# EasyEDA Pro project ProProject_智能车越野组英飞凌主板_2023-12-23.epro, schematic Schematic1_2

## Sheets
1 PWR: Create Date: 2023-11-16; Page Name: PWR; Project Name: 极速越野组别英飞凌主板; Schematic Name: Schematic1_2; Update Date: 2023-11-16; Company: 嘉立创EDA; Page Size: A4; Version: V1.0
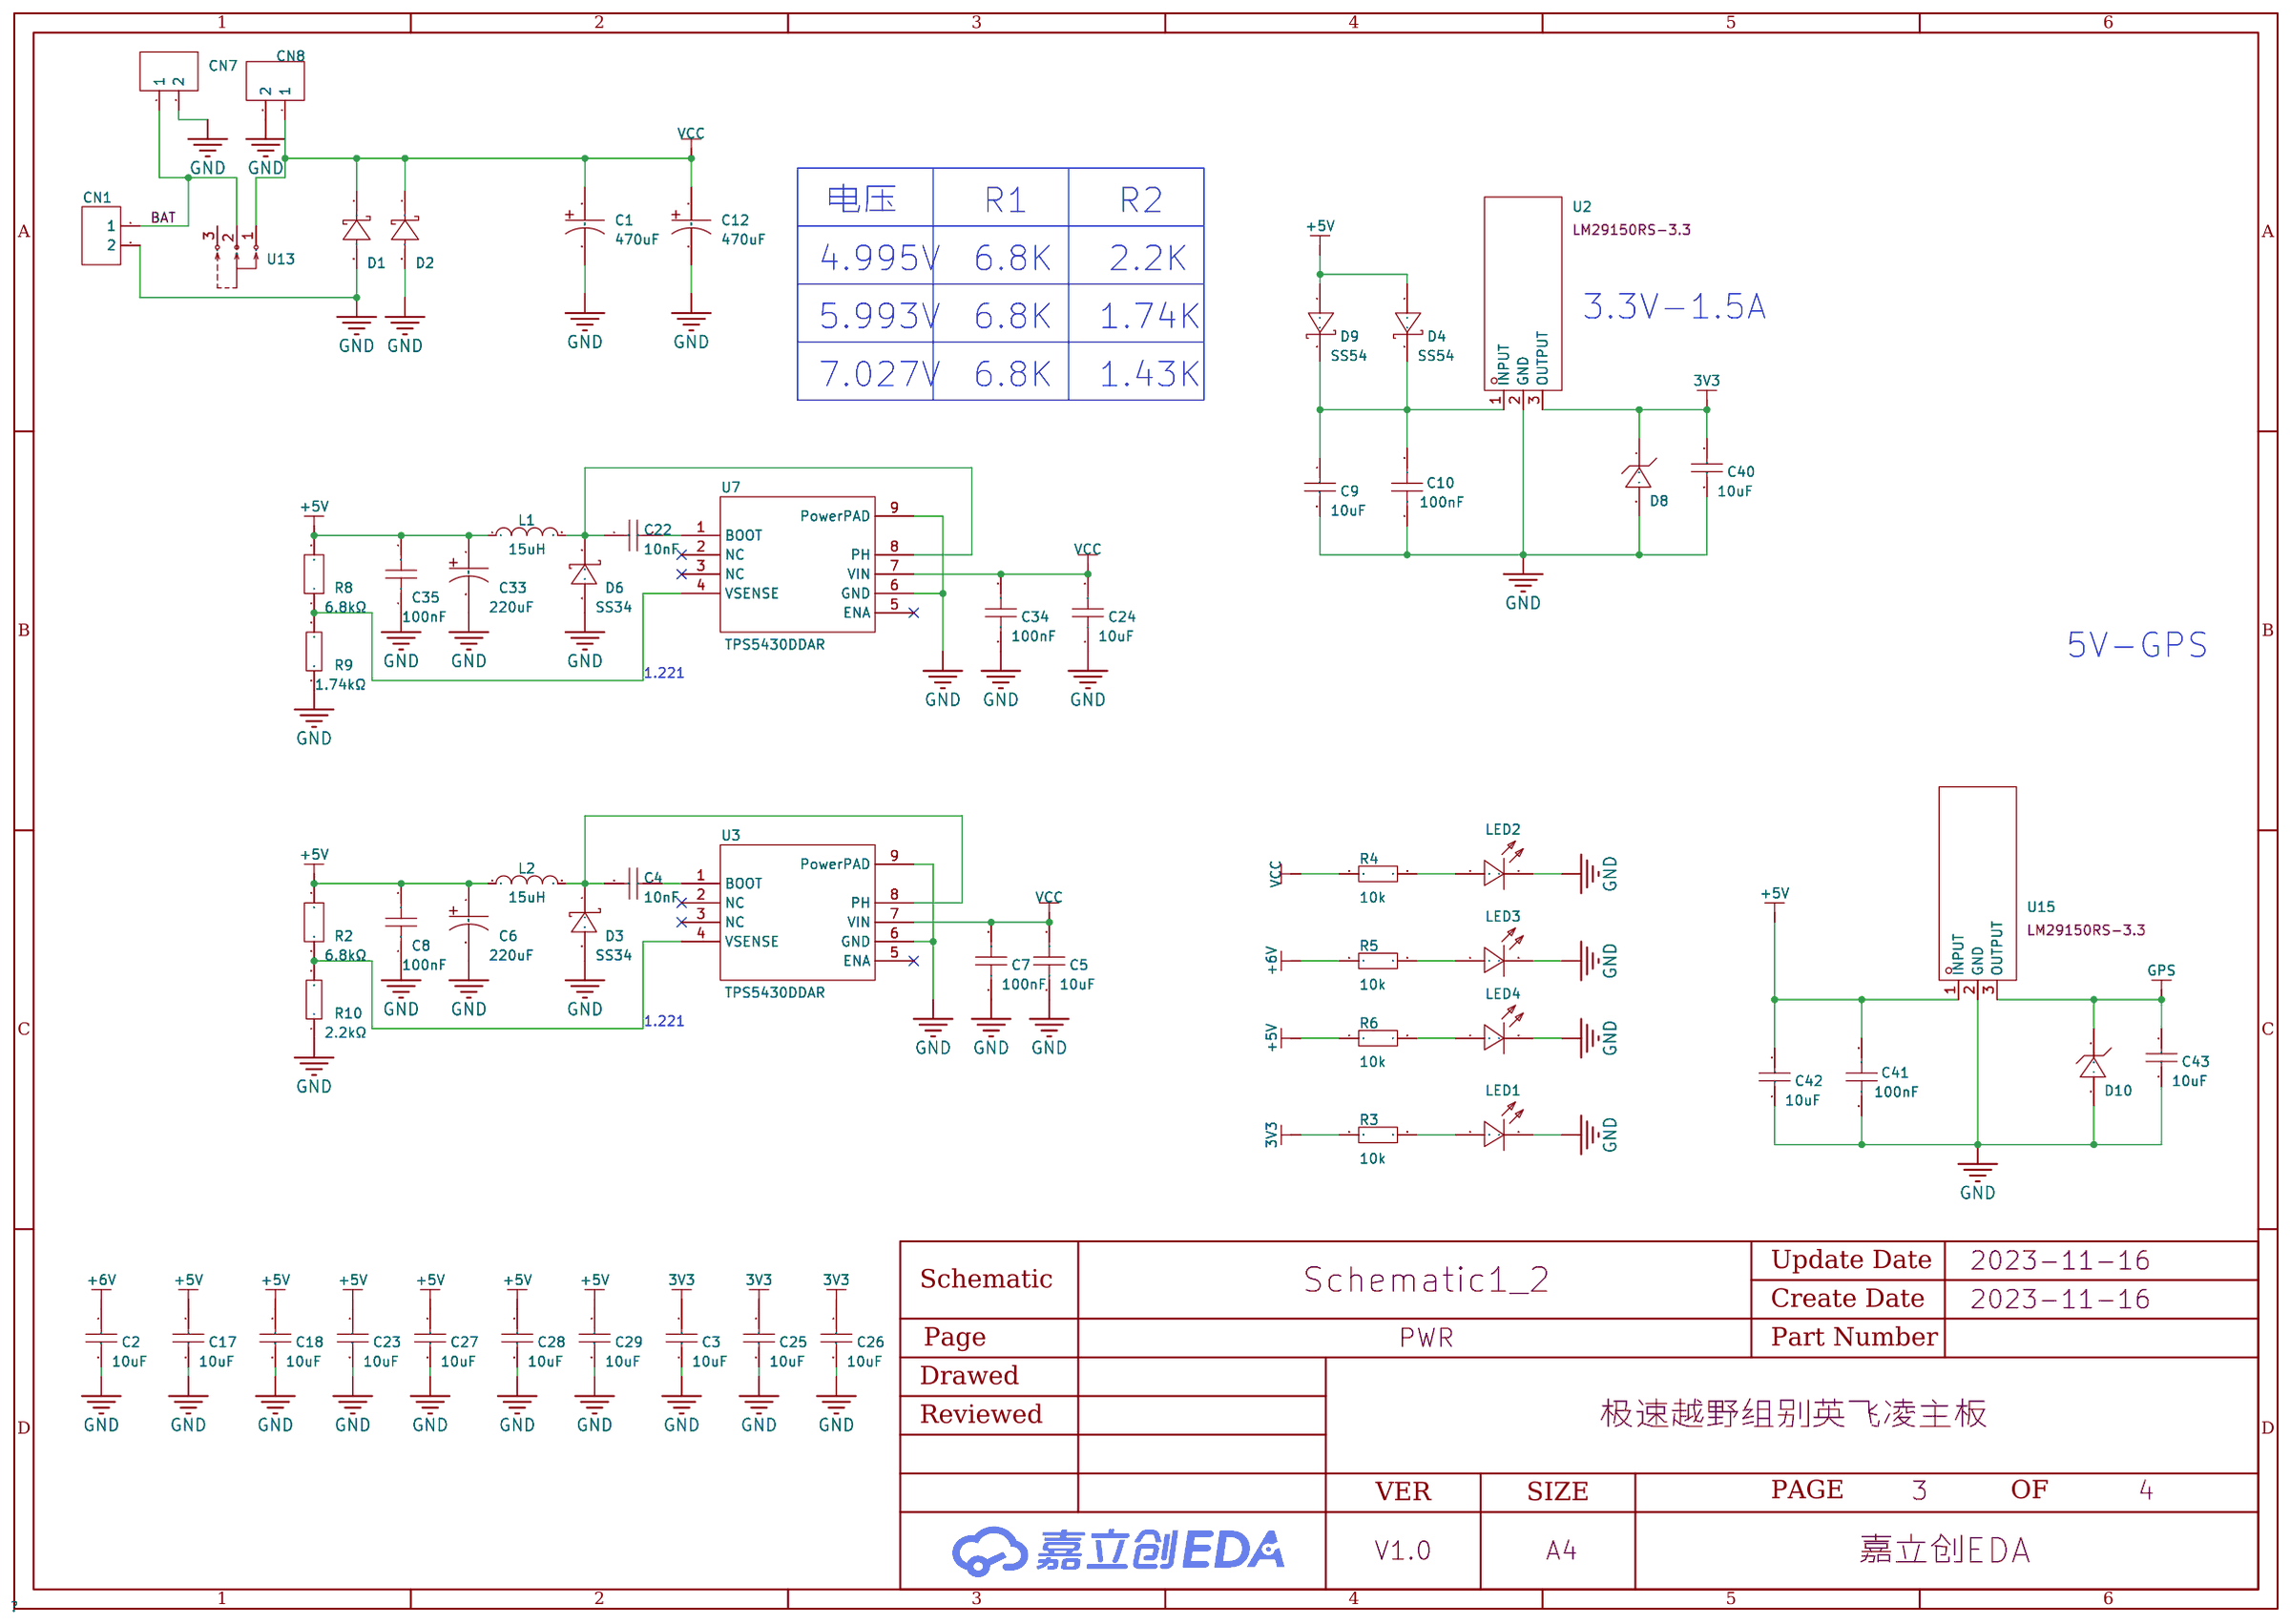
[diagram p0: PWR]
2 CTRL
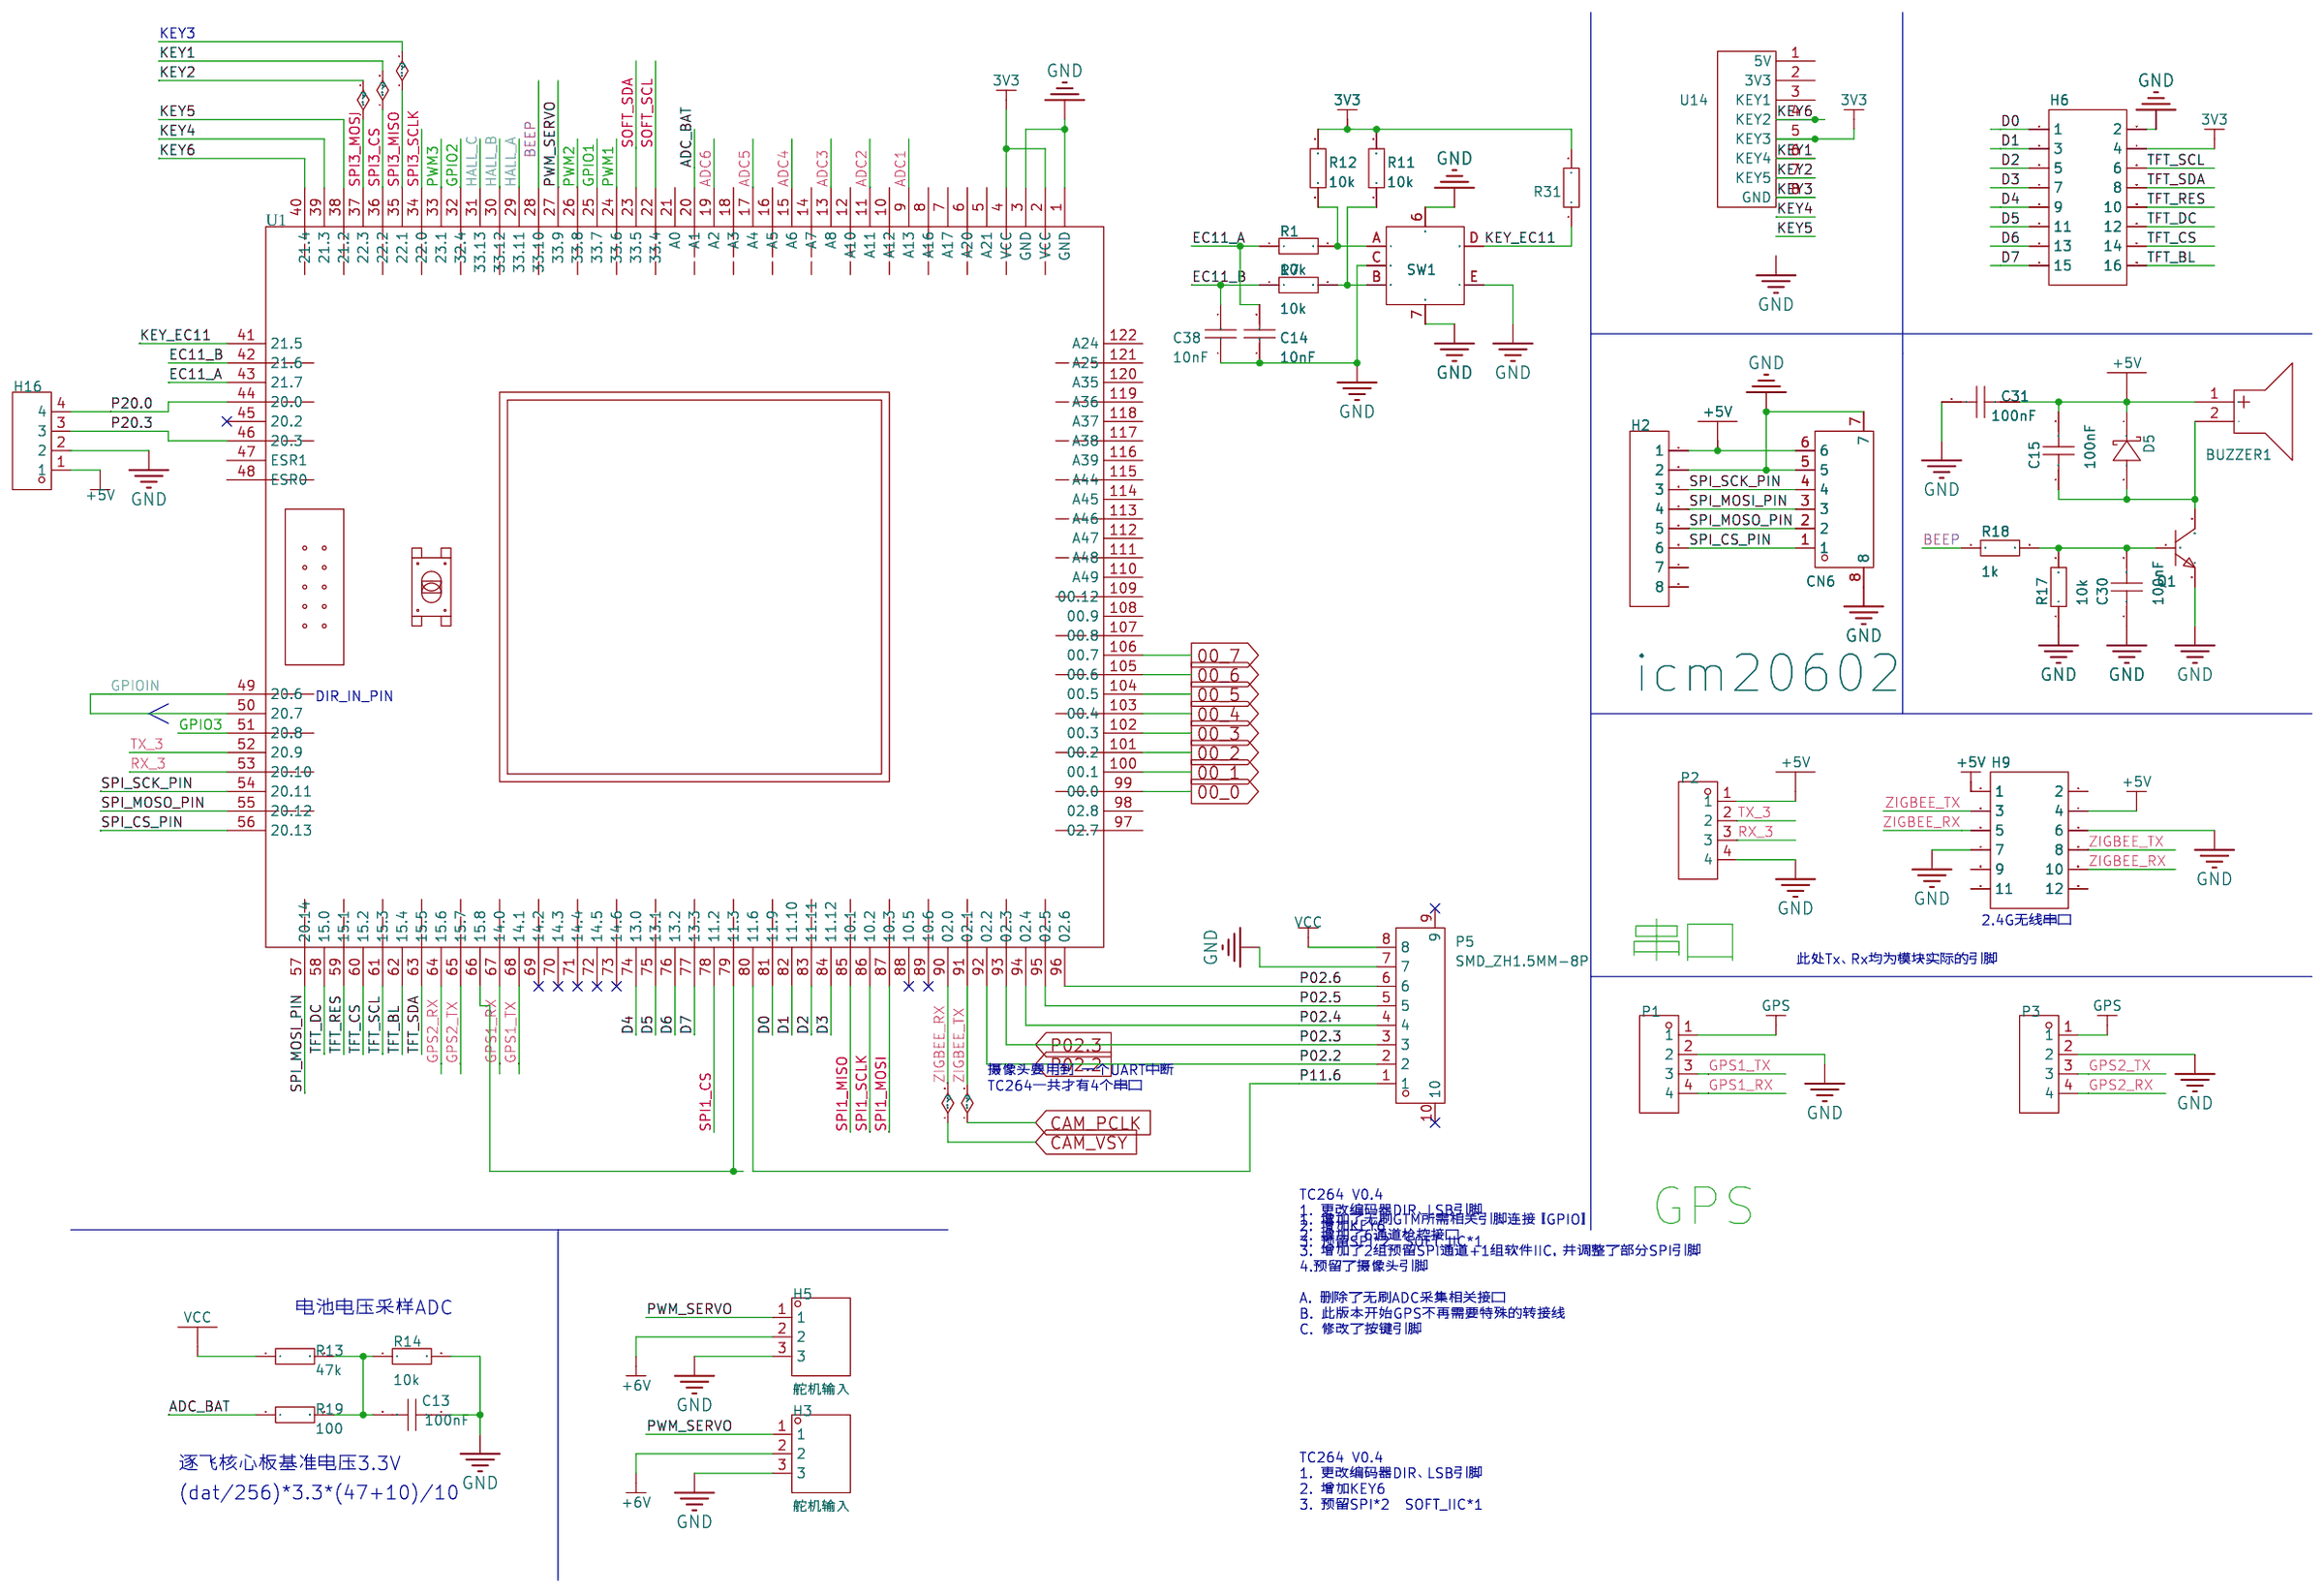
[diagram p1: CTRL]
3 BLDC
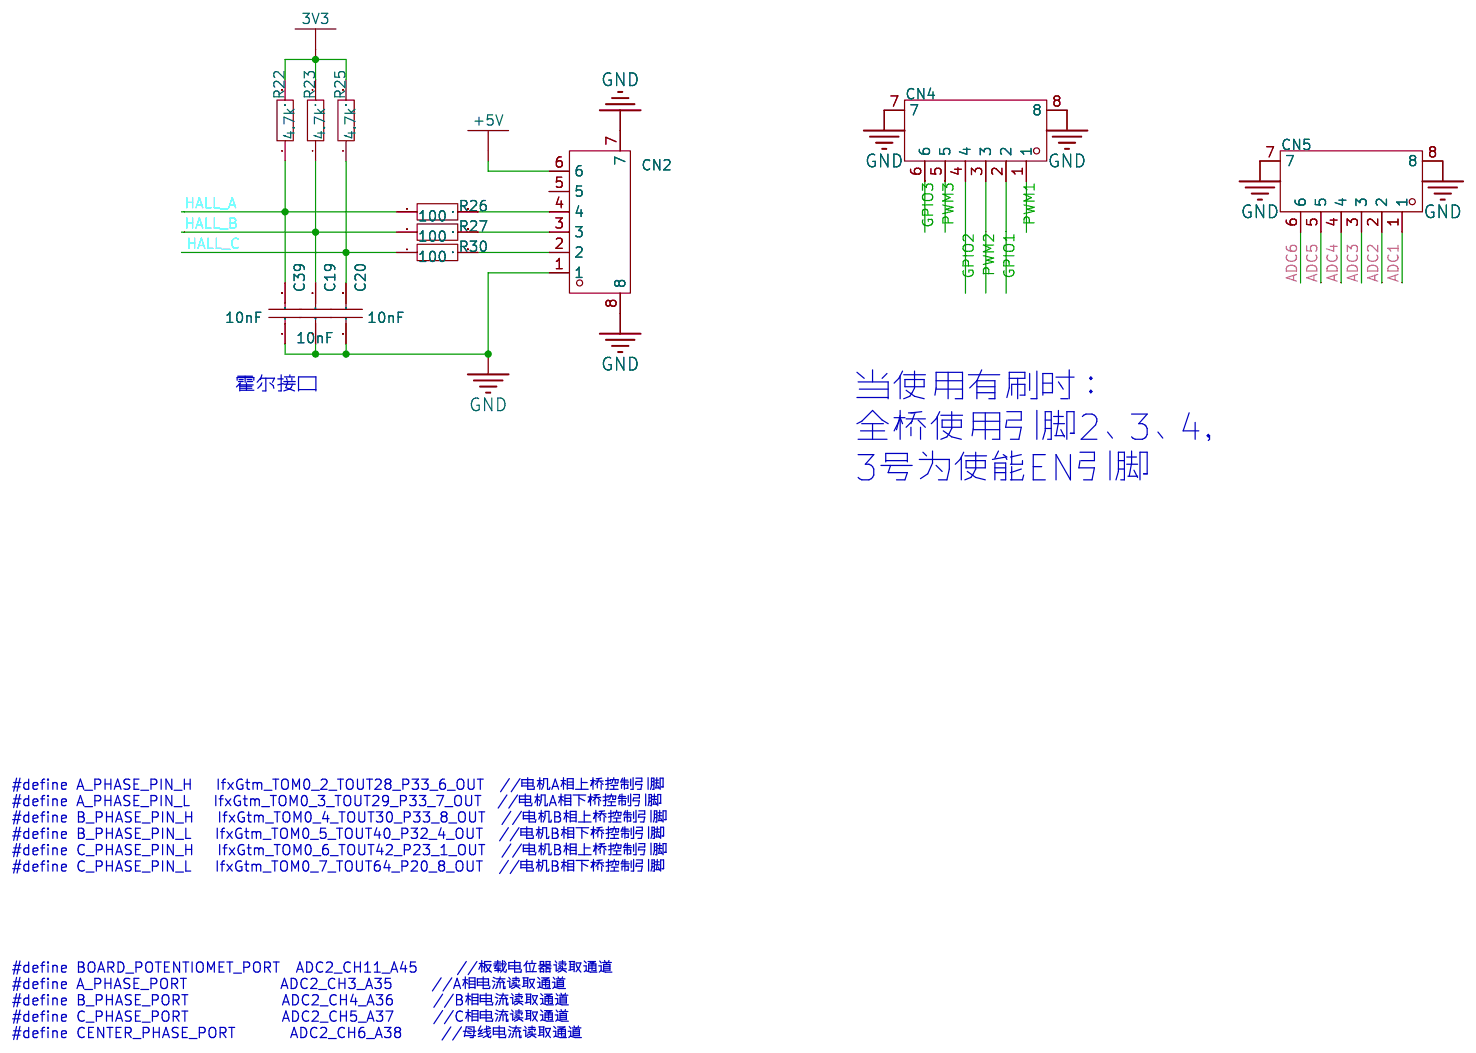
[diagram p2: BLDC]
4 STAND: Page Name: STAND; Company: 深圳嘉立创科技发展有限公司; Drawed: 嘉立创EDA; Page Size: A2; Part Number: JLCPCB-001; Reviewed: 嘉立创EDA; Version: V0.1
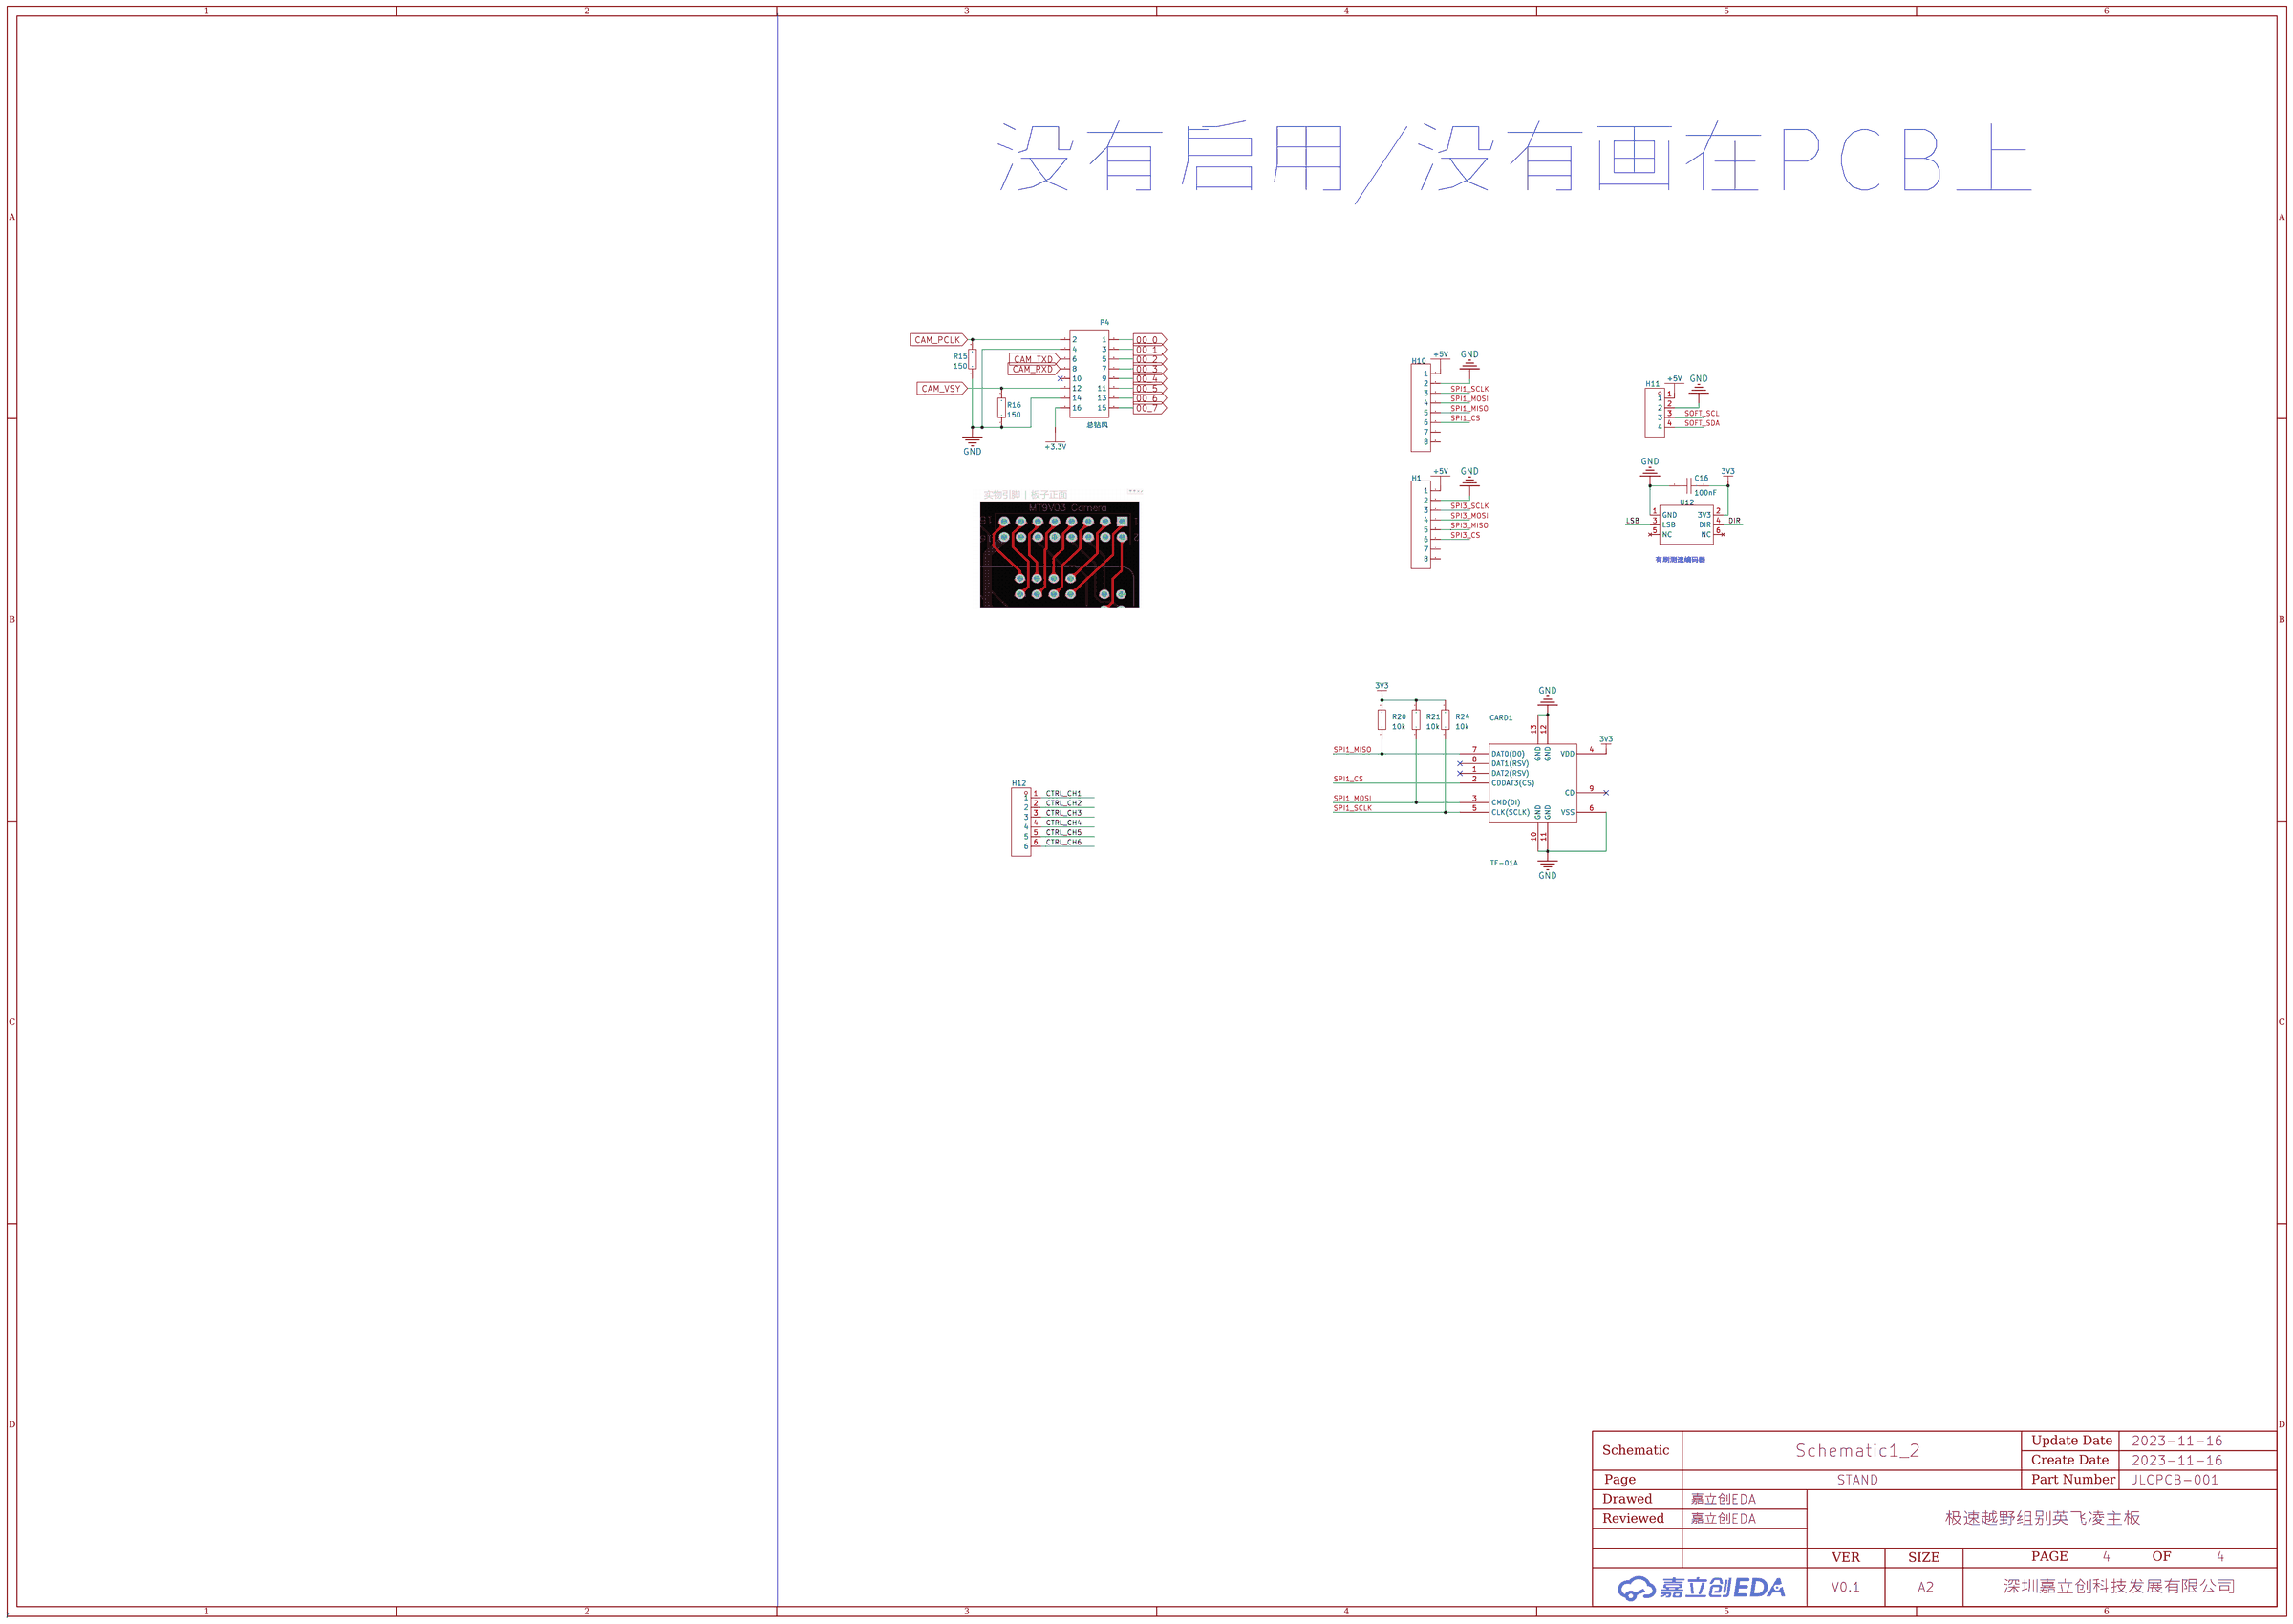
[diagram p3: STAND]

## Parts
sheet BLDC
C19  10nF  [C0603]
C20  10nF  [C0603]
C39  10nF  [C0603]
CN2  KH-ZH1.5WF-06A  [CONN-SMD_KH-ZH1.5WF-06A]
CN4  KH-ZH1.5WF-06A  [CONN-SMD_KH-ZH1.5WF-06A]
CN5  KH-ZH1.5WF-06A  [CONN-SMD_KH-ZH1.5WF-06A]
R22  4.7k  [R0603]
R23  4.7k  [R0603]
R25  4.7k  [R0603]
R26  100  [R0603]
R27  100  [R0603]
R30  100  [R0603]
sheet CTRL
BUZZER1  2048Hz  [BUZ-TH_BD12.0-P6.50-D0.6-FD]
C13  100nF  [C0603]
C14  10nF  [C0603]
C15  100nF  [C0603_2]
C30  100nF  [C0603_2]
C31  100nF  [C0603_2]
C38  10nF  [C0603]
CN6  KH-ZH1.5WF-06A  [CONN-SMD_KH-ZH1.5WF-06A]
D5  -  [SOD-123_L2.7-W1.6-LS3.7-RD]
H2  icm20602  [HDR-TH_8P-P2.54-V-F-1]
H3  舵机输入  [HDR-TH_3P-P2.54-V-M-1]
H5  舵机输入  [HDR-TH_3P-P2.54-V-M-1]
H6  -  [HDR-TH_16P-P2.54-V-M-R2-C8-S2.54]
H9  2.54-2*6P母  [HDR-TH_12P-P2.54-V-F-R2-C6-S2.54]
H16  -  [HDR-TH_4P-P2.54-V-F]
P1  陀螺仪  [CONN-TH_4P-P2.50-XH2.54-4P]
P2  陀螺仪  [CONN-TH_4P-P2.50-XH2.54-4P]
P3  陀螺仪  [CONN-TH_4P-P2.50-XH2.54-4P]
P5  SMD_ZH1.5MM-8P  [CONN-SMD_8P-P1.50_HCTL_HC-ZH-8PWT]
Q1  -  [SOT-23-3_L3.0-W1.7-P0.95-LS2.9-BR]
R1  10k  [R0603]
R7  10k  [R0603]
R11  10k  [R0603]
R12  10k  [R0603]
R13  47k  [R0603]
R14  10k  [R0603]
R17  10k  [R0603_3]
R18  1k  [R0603_3]
R19  100  [R0603]
R31  0603WAF4701T5E  [R0603]
SW1  EC11L1525E05  [SW-TH_EC11L1525E05]
U1  TC264_CoreBoard  [TC系列V0.2]
U14  -  [5个按键C]
sheet PWR
C1  470uF  [CAP-TH_BD8.0-P3.50-D0.6-FD_1]
C2  10uF  [C0805]
C3  10uF  [C0805]
C4  10nF  [C0603]
C5  10uF  [C0805]
C6  220uF  [CAP-TH_BD8.0-P3.50-D0.6-FD_1]
C7  100nF  [C0603]
C8  100nF  [C0603]
C9  10uF  [C0805]
C10  100nF  [C0603_1]
C12  470uF  [CAP-TH_BD8.0-P3.50-D0.6-FD_1]
C17  10uF  [C0805]
C18  10uF  [C0805]
C22  10nF  [C0603]
C23  10uF  [C0805]
C24  10uF  [C0805]
C25  10uF  [C0805]
C26  10uF  [C0805]
C27  10uF  [C0805]
C28  10uF  [C0805]
C29  10uF  [C0805]
C33  220uF  [CAP-TH_BD8.0-P3.50-D0.6-FD_1]
C34  100nF  [C0603]
C35  100nF  [C0603]
C40  10uF  [C0805]
C41  100nF  [C0603_1]
C42  10uF  [C0805]
C43  10uF  [C0805]
CN1  XT30UPB-F  [CONN-TH_XT30UPB-F]
CN7  XT30UPB-F  [CONN-TH_XT30UPB-F]
CN8  XT30UPB-F  [CONN-TH_XT30UPB-F]
D1  SMAJ12A  [DO-214AC_L4.3-W2.7-LS5.0-RD]  (no BOM)
D2  SMAJ12A  [DO-214AC_L4.3-W2.7-LS5.0-RD]  (no BOM)
D3  SS34  [DO-214AC_L4.3-W2.7-LS5.3-RD]
D4  SS54  [SMA_L4.4-W2.8-LS5.4-R-RD]
D6  SS34  [DO-214AC_L4.3-W2.7-LS5.3-RD]
D8  ZMM3V3-M  [LL-34_L3.5-W1.5-RD]
D9  SS54  [SMA_L4.4-W2.8-LS5.4-R-RD]
D10  ZMM3V3-M  [LL-34_L3.5-W1.5-RD]
L1  15uH  [IND-SMD_L7.4-W6.6]
L2  15uH  [IND-SMD_L7.4-W6.6]
LED1  KT-0603R  [LED0603-R-RD]
LED2  KT-0603R  [LED0603-R-RD]
LED3  KT-0603R  [LED0603-R-RD]
LED4  KT-0603R  [LED0603-R-RD]
R2  6.8kΩ  [R0603]
R3  10k  [R0603]
R4  10k  [R0603]
R5  10k  [R0603]
R6  10k  [R0603]
R8  6.8kΩ  [R0603]
R9  1.74kΩ  [R0603]
R10  2.2kΩ  [R0603]
U2  LM29150RS-3.3  [TO-252-2_L6.6-W6.1-P4.57-LS9.9-BR-CW]
U3  TPS5430DDAR  [SOIC-8_L5.0-W4.0-P1.27-LS6.0-BL-EP2.0]
U7  TPS5430DDAR  [SOIC-8_L5.0-W4.0-P1.27-LS6.0-BL-EP2.0]
U13  HX SS12D10G4  [SW-TH_SHOU-HAN_SS12D10G4]
U15  LM29150RS-3.3  [TO-252-2_L6.6-W6.1-P4.57-LS9.9-BR-CW]
sheet STAND
C16  100nF  [C0603_2]
CARD1  TF-01A  [TF-SMD_TF-01A]
H1  -  [HDR-TH_8P-P2.54-V-F-1]
H10  -  [HDR-TH_8P-P2.54-V-F-1]
H11  -  [HDR-TH_4P-P2.54-V-F]
H12  -  [HDR-TH_6P-P2.54-V-F_1]
P4  总钻风  [HDR-TH_16P-P2.54-V-M-R2-C8-S2.54]
R15  150  [R0603_3]
R16  150  [R0603_3]
R20  10k  [R0603]
R21  10k  [R0603]
R24  10k  [R0603]
U12  带方向编码器A  [IDC-TH_6P-P2.54_C11214]

## Library data of the parts
C4 C14 C19 C20 C22 C38 C39 = 0603B103K500NT: 容值:10nF;精度:±10%;额定电压:50V;材质(温度系数):X7R;; LCSC Part Name: 10nF ±10% 50V; Supplier Part: C57112; Manufacturer: FH(风华); Supplier Footprint: 0603; JLCPCB Part Class: 基础库; Datasheet: https://atta.szlcsc.com/upload/public/pdf/source/20170923/C57112_1506149495135988846.pdf; Supplier: LCSC; Tolerance: ±10%; Voltage Rated: 50V; Temperature Coefficient: X7R
CN2 CN4-CN6 = KH-ZH1.5WF-06A: 参考系列:-;间距:1.5mm;插针结构:1x6P;排数:1;每排PIN数:6;行距:-;公母:公型插针;安装方式:卧贴;额定电流:500mA;工作温度范围:-25℃~+85℃;; LCSC Part Name: 6P 1.5mm; Supplier Part: C2688783; Manufacturer: kinghelm(金航标); Supplier Footprint: SMD,P=1.5mm; JLCPCB Part Class: 扩展库; Datasheet: https://atta.szlcsc.com/upload/public/pdf/source/20210202/C2688783_C9B428B3014D7ABB89BDB1FE60180D57.pdf; Supplier: LCSC; Pitch: 1.5mm; Pins Structure: 1x6P; Number of Rows: 1; Number of PINs Per Row: 6; Gender: 公型插针; Mounting Style: 卧贴; Current Rating (Max): 500mA; Operating Temperature Range: -25℃~+85℃
R22 R23 R25 = 0603WAF4701T5E: 电阻类型:厚膜电阻;阻值:4.7k;精度:±1%;功率:1/10W;温度系数:±100ppm/;最大工作电压:75V;工作温度范围:-55~+155;; LCSC Part Name: 4.7k ±1%; Supplier Part: C23162; Manufacturer: UNI-ROYAL(厚声); Supplier Footprint: 0603; Datasheet: https://atta.szlcsc.com/upload/public/pdf/source/20200306/C422600_1E6D84923E4A46A82E41ADD87F860B5C.pdf; Supplier: LCSC; Type: 厚膜电阻; Tolerance: ±1%; Power(Watts): 1/10W; Temperature Coefficient: ±100ppm/; Overload Voltage (Max): 75V; Operating Temperature Range: -55~+155; JLCPCB Part Class: Basic Part
R19 R26 R27 R30 = 0603WAF1000T5E: 电阻类型:厚膜电阻;阻值:100;精度:±1%;功率:1/10W;温度系数:±200ppm/;最大工作电压:75V;工作温度范围:-55~+155;; LCSC Part Name: 100 ±1%; Supplier Part: C22775; Manufacturer: UNI-ROYAL(厚声); Supplier Footprint: 0603; Datasheet: https://atta.szlcsc.com/upload/public/pdf/source/20200306/C422600_1E6D84923E4A46A82E41ADD87F860B5C.pdf; Supplier: LCSC; Type: 厚膜电阻; Tolerance: ±1%; Power(Watts): 1/10W; Temperature Coefficient: ±200ppm/; Overload Voltage (Max): 75V; Operating Temperature Range: -55~+155; JLCPCB Part Class: Basic Part
BUZZER1 = GMC1205YA-16R2048: 驱动方式:无源(外部驱动);构造类型:电磁式;额定电压:3.3V;工作电压:2V~5V;频率:2048Hz;声压(SPL):80dB@3.3V,10cm;直径(φD):12mm;高度:5.6mm;; Supplier Part: C252915; Manufacturer: INGHAi(赢海); Supplier Footprint: 插件,P=6.5mm; JLCPCB Part Class: 扩展库; Datasheet: https://atta.szlcsc.com/upload/public/pdf/source/20180813/C252915_6F296D577EDE0D1B468E4E6A82DE9B37.pdf; Supplier: LCSC; Oscillator Circuit: 无源(外部驱动); Technology Type: 电磁式; Rated Voltage: 3.3V; Operating Voltage: 2V~5V; Sound Pressure Level (SPL): 80dB@3.3V,10cm; Diameter (φD): 12mm; Height: 5.6mm
C13 = CC0603KRX7R9BB104: 容值:100nF;精度:±10%;额定电压:50V;温度系数:X7R;; LCSC Part Name: 100nF ±10% 50V; Supplier Part: C14663; Manufacturer: YAGEO(国巨); Supplier Footprint: 0603; Datasheet: https://atta.szlcsc.com/upload/public/pdf/source/20170116/1484561234239.pdf; Supplier: LCSC; Tolerance: ±10%; Voltage Rated: 50V; Temperature Coefficient: X7R; JLCPCB Part Class: Basic Part
C15 C16 C30 C31 = CC0603KRX7R9BB104_4: 容值:100nF;精度:±10%;额定电压:50V;温度系数:X7R;; LCSC Part Name: 100nF ±10% 50V; Supplier Part: C14663; Manufacturer: YAGEO(国巨); Manufacturer Part: CC0603KRX7R9BB104; Supplier Footprint: 0603; Datasheet: https://atta.szlcsc.com/upload/public/pdf/source/20170116/1484561234239.pdf; Supplier: LCSC; Tolerance: ±10%; Voltage Rated: 50V; Temperature Coefficient: X7R; JLCPCB Part Class: Basic Part
D5 = 1N5819W_C963381: 二极管配置:独立式;直流反向耐压(Vr):40V;平均整流电流(Io):350mA;正向压降(Vf):600mV@200mA;反向电流(Ir):5A@30V;; LCSC Part Name: 40V 350mA 600mV@200mA; Supplier Part: C963381; Manufacturer: JSMSEMI(杰盛微); Manufacturer Part: 1N5819W; Supplier Footprint: SOD-123; Datasheet: https://atta.szlcsc.com/upload/public/pdf/source/20211201/C266112E93E924DFE0C071C9A8E85281.pdf; Supplier: LCSC; Diode Configuration: 独立式; Reverse Voltage (Vr): 40V; Average Rectified Current (Io): 350mA; Forward Voltage (Vf@If): 600mV@200mA; Reverse Leakage Current (Ir): 5A@30V; JLCPCB Part Class: Extended Part
H1 H2 H10 = HDR-F_2.54_1x8P: Supplier Part: C27438; Supplier Footprint: 插件
H3 H5 = 77311-102-03LF: 间距:2.54mm;总PIN位数:3;排数:1;插针结构:-;行距:-;安装类型:直插;圆针/方针:-;额定电流:-;额定电压:-;配合针长度:-;塑高:-;触头材质:磷青铜;触头镀层:-;颜色:黑色;; LCSC Part Name: 2.54mm; Supplier Part: C180248; Manufacturer: Amphenol; Supplier Footprint: 插件,P=2.54mm; Datasheet: https://atta.szlcsc.com/upload/public/pdf/source/20180329/C180248_62E264527695F7ED58561BB828D45E42.pdf; Supplier: LCSC; Pitch: 2.54mm; Number of Pins: 3; Number of Rows: 1; Mounting Type: 直插; Contact Material: 磷青铜; Color: 黑色; JLCPCB Part Class: Extended Part
H6 = HDR-M_2.54_2x8: Supplier Part: C68234; Supplier Footprint: 插件,P=2.54mm
H9 = 2.54-2*6P母: 间距:2.54mm;总孔位数:12;排数:2;插孔结构:2x6P;行距:2.54mm;安装类型:直插;塑高:-;触头材质:黄铜;触头镀层:-;; LCSC Part Name: 2.54mm 2x6P; Supplier Part: C36191; Manufacturer: BOOMELE(博穆精密); Supplier Footprint: 直插,P=2.54mm; JLCPCB Part Class: 扩展库; Datasheet: https://atta.szlcsc.com/upload/public/pdf/source/20151109/1457707557808.pdf; Supplier: LCSC; Pitch: 2.54mm; Number of Holes: 12; Number of Rows: 2; Holes Structure: 2x6P; Row Spacing: 2.54mm; Mounting Type: 直插; Contact Material: 黄铜
H11 H16 = HDR-F_2.54_1x4P: Supplier Part: C2718488; Supplier Footprint: 插件
P1-P3 = XH2.54-4P: Supplier Part: C9900003326; Supplier: LCSC; JLCPCB Part Class: Extended Part
P5 = SMD_ZH1.5MM-8P: Supplier Part: C9900016891; Supplier Footprint: ZH1.5-8P贴片卧式; JLCPCB Part Class: Extended Part; Datasheet: https://atta.szlcsc.comnull; Supplier: LCSC
Q1 = S8050 J3Y: 晶体管类型:NPN;集射极击穿电压(Vceo):25V;集电极电流(Ic):500mA;功率(Pd):300mW;集电极-发射极饱和电压(VCE(sat)@Ic,Ib):600mV@500mA,50mA;直流电流增益(hFE@Ic,Vce):200@50mA,1V;特征频率(fT):150MHz;工作温度:+150@(Tj);; LCSC Part Name: S8050 J3Y (200-350) (200-350); Supplier Part: C2146; Manufacturer: CJ（江苏长电/长晶）; Supplier Footprint: SOT-23(SOT-23-3); Datasheet: https://atta.szlcsc.com/upload/public/pdf/source/20140809/1457707209234.pdf; Supplier: LCSC; Transistor Type: NPN; Collector-Emitter Breakdown Voltage (Vceo): 25V; Collector Current (Ic): 500mA; Power Dissipation (Pd): 300mW; Collector-Emitter Saturation Voltage (VCE(sat)@Ic,Ib): 600mV@500mA,50mA; DC Current Gain (hFE@Ic,Vce): 200@50mA,1V; Transition Frequency (fT): 150MHz; Operating Temperature: +150@(Tj); JLCPCB Part Class: Basic Part
R1 R3-R7 R11 R12 R14 R20 R21 R24 = 0603WAF1002T5E: 电阻类型:厚膜电阻;阻值:10k;精度:±1%;功率:1/10W;温度系数:±100ppm/;最大工作电压:75V;工作温度范围:-55~+155;; LCSC Part Name: 10k ±1%; Supplier Part: C25804; Manufacturer: UNI-ROYAL(厚声); Supplier Footprint: 0603; Datasheet: https://atta.szlcsc.com/upload/public/pdf/source/20200306/C422600_1E6D84923E4A46A82E41ADD87F860B5C.pdf; Supplier: LCSC; Type: 厚膜电阻; Tolerance: ±1%; Power(Watts): 1/10W; Temperature Coefficient: ±100ppm/; Overload Voltage (Max): 75V; Operating Temperature Range: -55~+155; JLCPCB Part Class: Basic Part
R13 = 0603WAF4702T5E: 电阻类型:厚膜电阻;阻值:47k;精度:±1%;功率:1/10W;温度系数:±100ppm/;最大工作电压:75V;工作温度范围:-55~+155;; LCSC Part Name: 47k ±1%; Supplier Part: C25819; Manufacturer: UNI-ROYAL(厚声); Supplier Footprint: 0603; Datasheet: https://atta.szlcsc.com/upload/public/pdf/source/20200306/C422600_1E6D84923E4A46A82E41ADD87F860B5C.pdf; Supplier: LCSC; Type: 厚膜电阻; Tolerance: ±1%; Power(Watts): 1/10W; Temperature Coefficient: ±100ppm/; Overload Voltage (Max): 75V; Operating Temperature Range: -55~+155; JLCPCB Part Class: Basic Part
R17 = 0603WAF1002T5E_3: 电阻类型:厚膜电阻;阻值:10k;精度:±1%;功率:1/10W;温度系数:±100ppm/;最大工作电压:75V;工作温度范围:-55~+155;; LCSC Part Name: 10k ±1%; Supplier Part: C25804; Manufacturer: UNI-ROYAL(厚声); Manufacturer Part: 0603WAF1002T5E; Supplier Footprint: 0603; Datasheet: https://atta.szlcsc.com/upload/public/pdf/source/20200306/C422600_1E6D84923E4A46A82E41ADD87F860B5C.pdf; Supplier: LCSC; Type: 厚膜电阻; Tolerance: ±1%; Power(Watts): 1/10W; Temperature Coefficient: ±100ppm/; Overload Voltage (Max): 75V; Operating Temperature Range: -55~+155; JLCPCB Part Class: Basic Part
R18 = 0603WAF1001T5E: 电阻类型:厚膜电阻;阻值:1k;精度:±1%;功率:1/10W;温度系数:±100ppm/;最大工作电压:75V;工作温度范围:-55~+155;; LCSC Part Name: 1k ±1%; Supplier Part: C21190; Manufacturer: UNI-ROYAL(厚声); Supplier Footprint: 0603; Datasheet: https://atta.szlcsc.com/upload/public/pdf/source/20200306/C422600_1E6D84923E4A46A82E41ADD87F860B5C.pdf; Supplier: LCSC; Type: 厚膜电阻; Tolerance: ±1%; Power(Watts): 1/10W; Temperature Coefficient: ±100ppm/; Overload Voltage (Max): 75V; Operating Temperature Range: -55~+155; JLCPCB Part Class: Basic Part
R31 = 0603WAF4701T5E_1: LCSC Part Name: 4.7KΩ(4701) ±1% 编带; Supplier Part: C23162; Manufacturer: UNI-ROYAL(厚声); Supplier Footprint: 0603; JLCPCB Part Class: 基础库; Datasheet: https://atta.szlcsc.com/upload/public/pdf/source/20170920/C23162_1505901109673982545.pdf; Supplier: LCSC
SW1 = EC11L1525E05: LCSC Part Name: 编码器; Supplier Part: C2687298; Manufacturer: ALPSALPINE(阿尔卑斯阿尔派); Supplier Footprint: 插件; JLCPCB Part Class: 扩展库; Datasheet: https://atta.szlcsc.com/upload/public/pdf/source/20210222/C2687298_D85F935961A23A0DB1B474C7A2A10B19.pdf; Supplier: LCSC
U1 = TC264_CoreBoard: ---TC264----; _: 3
U14 = 5个按键C
C1 C6 C12 C33 = RZW471M1EBK-0815: 容值:470uF;精度:±20%;额定电压:25V;电容体直径:8mm;电容体长度:15mm;脚间距:3.5mm;工作寿命:7000hrs@105℃;; LCSC Part Name: 470uF ±20% 25V; Supplier Part: C335050; Manufacturer: lelon(立隆); Supplier Footprint: 径向引线,8x15mm; JLCPCB Part Class: 扩展库; Datasheet: https://atta.szlcsc.com/upload/public/pdf/source/20181120/C335050_51DA6CA8493D35BF3B1E9837637D07CE.pdf; Supplier: LCSC; Tolerance: ±20%; Rated Voltage: 25V; φD: 8mm; L: 15mm; Lead Spacing: 3.5mm; Lifetime @ Temp: 7000hrs@105℃
C2 C3 C9 C17 C18 C23 C25-C29 C40 C42 C43 = CL21A106KAYNNNE: 容值:10uF;精度:±10%;额定电压:25V;温度系数:X5R;; LCSC Part Name: 10uF ±10% 25V; Supplier Part: C15850; Manufacturer: SAMSUNG(三星); Supplier Footprint: 0805; Datasheet: https://atta.szlcsc.com/upload/public/pdf/source/20160103/1457707679302.pdf; Supplier: LCSC; Tolerance: ±10%; Voltage Rated: 25V; Temperature Coefficient: X5R; JLCPCB Part Class: Basic Part
C5 C24 = GRT21BC71E106KE13L: 容值:10uF;精度:±10%;额定电压:-;材质(温度系数):-;; LCSC Part Name: 10uF ±10%; Supplier Part: C882505; Manufacturer: muRata(村田); Supplier Footprint: 0805; JLCPCB Part Class: 扩展库; Datasheet: https://atta.szlcsc.com/upload/public/pdf/source/20201228/C882505_6C63D8D57C6472D033E3095FB59E12C2.pdf; Supplier: LCSC; Tolerance: ±10%
C7 C8 C34 C35 = CL10B104KC8NNNC: 容值:100nF;精度:±10%;额定电压:100V;材质(温度系数):X7R;; LCSC Part Name: 100nF ±10% 100V; Supplier Part: C15725; Manufacturer: SAMSUNG(三星); Supplier Footprint: 0603; JLCPCB Part Class: 扩展库; Datasheet: https://atta.szlcsc.com/upload/public/pdf/source/20160103/1457707678663.pdf; Supplier: LCSC; Tolerance: ±10%; Voltage Rated: 100V; Temperature Coefficient: X7R
C10 C41 = CC0603KRX7R9BB104_1: 容值:100nF;精度:±10%;额定电压:50V;温度系数:X7R;; LCSC Part Name: 100nF ±10% 50V; Supplier Part: C14663; Manufacturer: YAGEO(国巨); Manufacturer Part: CC0603KRX7R9BB104; Supplier Footprint: 0603; Datasheet: https://atta.szlcsc.com/upload/public/pdf/source/20170116/1484561234239.pdf; Supplier: LCSC; Tolerance: ±10%; Voltage Rated: 50V; Temperature Coefficient: X7R; JLCPCB Part Class: Basic Part
CN1 CN7 CN8 = XT30UPB-F: 模型插头连接器; Supplier Part: C108769; Manufacturer: AMASS(艾迈斯); Supplier Footprint: 间距5mm; JLCPCB Part Class: 扩展库; Datasheet: https://atta.szlcsc.com/upload/public/pdf/source/20180126/C108769_15169557890251308829.pdf; Supplier: LCSC
D1 D2 = SMAJ12A_C2760874: 极性:单向;反向截止电压(Vrwm):12V;击穿电压(最小值):13.3V;击穿电压(最大值):14.7V;反向漏电流(Ir):5A;峰值脉冲电流(Ipp)@10/1000s:20.1A;最大钳位电压:19.9V;峰值脉冲功率(Ppp)@10/1000s:400W;; LCSC Part Name: 单向 12V 400W; Supplier Part: C2760874; Manufacturer: Slkor(萨科微); Supplier Footprint: DO-214AC; JLCPCB Part Class: 扩展库; Datasheet: https://atta.szlcsc.com/upload/public/pdf/source/20200225/C488404_33CF829A6BE74AA3BA3BAD7F337BBDC5.pdf; Supplier: LCSC; Polarity: 单向; Reverse Stand-Off Voltage (Vrwm): 12V; Breakdown Voltage (Min): 13.3V; Breakdown Voltage (Max): 14.7V; Reverse Leakage Current (Ir): 5A; Peak Pulse Current (Ipp)@10/1000μs: 20.1A; Maximum Clamping Voltage: 19.9V; Peak Pulse Power Dissipation (Ppp)@10/1000μs: 400W
D3 D6 = SS34_C8678: 40V,3A,VF=0.55V 3A; Supplier Part: C8678; Manufacturer: MDD; Supplier Footprint: SMA(DO-214AC); JLCPCB Part Class: 基础库; Datasheet: https://atta.szlcsc.com/upload/public/pdf/source/20220408/D0396E57A6E83C6AFC0ED25EC9EDE030.pdf; Supplier: LCSC
D4 D9 = SS54_C22452: 直流反向耐压(Vr):40V;平均整流电流(Io):5A;正向压降(Vf):550mV@5A;; LCSC Part Name: 40V 5A 550mV@5A; Supplier Part: C22452; Manufacturer: MDD; Supplier Footprint: SMA(DO-214AC); Datasheet: https://atta.szlcsc.com/upload/public/pdf/source/20190306/C22452_DC5E4F74C3B638F6D8E4C7650D5BF30E.pdf; Supplier: LCSC; Reverse Voltage (Vr): 40V; Average Rectified Current (Io): 5A; Forward Voltage (Vf@If): 550mV@5A
D8 D10 = ZMM3V3-M: 二极管配置:独立式;稳压值(标称值):3.3V;稳压值(范围):3.1V~3.5V;精度:-;功率:500mW;反向电流(Ir):2uA@1V;阻抗(Zzt):85Ω;; LCSC Part Name: 3.3V 500mW; Supplier Part: C8056; Manufacturer: ST(先科); Supplier Footprint: LL-34; JLCPCB Part Class: 基础库; Datasheet: https://atta.szlcsc.com/upload/public/pdf/source/20120512/1457706507365.pdf; Supplier: LCSC; Diode Configuration: 独立式; Zener Voltage (Nom): 3.3V; Zener Voltage (Range): 3.1V~3.5V; Power Dissipation: 500mW; Reverse Leakage Current (Ir): 2uA@1V; Zener Impedance (Zzt): 85Ω
L1 L2 = CKST0603-15uH/M: 电感值:15uH;精度:±20%;额定电流:2.6A;饱和电流(Isat):3.8A;直流电阻(DCR):115mΩ;; LCSC Part Name: 15uH ±20% 2.6A 115mΩ; Supplier Part: C3002640; Manufacturer: CENKER(岑科); Supplier Footprint: SMD,7.4x6.6x3mm; JLCPCB Part Class: 扩展库; Datasheet: https://atta.szlcsc.com/upload/public/pdf/source/20220510/B48FE89972EB9627500571FF6CB43AFA.pdf; Supplier: LCSC; Tolerance: ±20%; Rated Current: 2.6A; Saturation Current (Isat): 3.8A; DC Resistance (DCR): 115mΩ
LED1-LED4 = KT-0603R: 发光颜色:红灯;二极管配置:-;透镜颜色:-;主波长:-;峰值波长:-;色温:-;光通量(25时):-;测试电流:-;正向电压(VF):-;发光强度:-;功率:-;发光角度:-;安装方式:-;工作温度:-40~+85;; LCSC Part Name: 红灯; Supplier Part: C2286; Manufacturer: KENTO; Supplier Footprint: 0603; JLCPCB Part Class: 基础库; Datasheet: https://atta.szlcsc.com/upload/public/pdf/source/20160616/1466072038404.pdf; Supplier: LCSC; Emitted Color: 红灯; Operating Temperature: -40~+85
R2 R8 = SG73P1JTTD1002F: 阻值:10kΩ;精度:±1%;功率:-;; LCSC Part Name: 10kΩ ±1%; Supplier Part: C880254; Manufacturer: KOA; Supplier Footprint: 0603; JLCPCB Part Class: 扩展库; Datasheet: https://atta.szlcsc.com/upload/public/pdf/source/20190109/C346159_A2BB9C83E7E727C8F8277542505B206B.pdf; Supplier: LCSC; Tolerance: ±1%
R9 R10 = RTT032551FTP: 阻值:2.55kΩ;精度:±1%;功率:100mW;温度系数:±100ppm/℃;; LCSC Part Name: 2.55kΩ ±1% 100mW; Supplier Part: C103467; Manufacturer: RALEC(旺诠); Supplier Footprint: 0603; JLCPCB Part Class: 扩展库; Datasheet: https://atta.szlcsc.com/upload/public/pdf/source/20170408/1491642882843.pdf; Supplier: LCSC; Tolerance: ±1%; Power(Watts): 100mW; Temperature Coefficient: ±100ppm/℃
U2 U15 = LM29150RS-3.3: 输出类型:-;; Supplier Part: C262538; Manufacturer: HTC; Supplier Footprint: TO-252-2(DPAK); JLCPCB Part Class: 扩展库; Datasheet: https://atta.szlcsc.com/upload/public/pdf/source/20180803/C262538_BD79E7C5B294A625C836D7B490C877B9.pdf; Supplier: LCSC
U3 U7 = TPS5430DDAR: 功能类型:降压型;同步整流:-;输出通道数:-;拓扑结构:-;输入电压:-;输出电流(最大值):-;开关频率:-;; LCSC Part Name: 降压型; Supplier Part: C9864; Manufacturer: TI(德州仪器); Supplier Footprint: SO-8; JLCPCB Part Class: 基础库; Datasheet: https://atta.szlcsc.com/upload/public/pdf/source/20161207/1481104217724.pdf; Supplier: LCSC; Function: 降压型
U13 = HX SS12D10G4: LCSC Part Name: 拨动开关 立式两档拨动,单排3脚插件,12.7x6.7x6.4,黑柄4mm; Supplier Part: C5149841; Manufacturer: hanxia(韩下); Supplier Footprint: DIP; Datasheet: https://atta.szlcsc.com/upload/public/pdf/source/20220907/2020D7183ED16DD6E2B9F5A13FB144CF.pdf; Supplier: LCSC
CARD1 = TF-01A_C91145: 工作温度范围:-;本体最大高度:-;触头镀层:-;连接器类型:卡座;卡类型:MicroSD卡(TF卡);焊接温度(最大值):-;触头材质:-;卡连接方式:自弹式;; Supplier Part: C91145; Manufacturer: 韩国韩荣; Supplier Footprint: SMD; JLCPCB Part Class: 扩展库; Datasheet: https://atta.szlcsc.com/upload/public/pdf/source/20190322/C91145_63CBD6FB4639A3A3EC6A9721F18AE0FB.pdf; Supplier: LCSC; Connector Type: 卡座; Card Type: MicroSD卡(TF卡); Card Connection Mode: 自弹式
H12 = HDR-F_2.54_1x6P_1: Supplier Part: C40877; Supplier Footprint: 插件
P4 = 2.54-2*8P针: 间距:2.54mm;总PIN位数:16;排数:2;插针结构:2x8P;行距:2.54mm;安装类型:直插;圆针/方针:方针;额定电流:-;额定电压:-;配合针长度:5.9mm;塑高:2.54mm;端接针长度:-;触头材质:-;触头镀层:-;工作温度范围:-;焊接温度(最大值):-;颜色:黑色;; LCSC Part Name: 2.54mm 2x8P; Supplier Part: C68234; Manufacturer: BOOMELE(博穆精密); Supplier Footprint: 插件,P=2.54mm; Datasheet: https://atta.szlcsc.com/upload/public/pdf/source/20201013/C68234_270B646BD674B577F54EFAA72CA8674A.pdf; Supplier: LCSC; Pitch: 2.54mm; Number of Pins: 16; Number of Rows: 2; Pin Structure: 2x8P; Row Spacing: 2.54mm; Mounting Type: 直插; Circluar Pins/Square Pins: 方针; Length of Mating Pin: 5.9mm; Insulation Height: 2.54mm; Color: 黑色; JLCPCB Part Class: Extended Part
R15 R16 = 0603WAF1500T5E: 电阻类型:厚膜电阻;阻值:150;精度:±1%;功率:1/10W;温度系数:±100ppm/;最大工作电压:75V;工作温度范围:-55~+155;; LCSC Part Name: 150 ±1%; Supplier Part: C22808; Manufacturer: UNI-ROYAL(厚声); Supplier Footprint: 0603; Datasheet: https://atta.szlcsc.com/upload/public/pdf/source/20200306/C422600_1E6D84923E4A46A82E41ADD87F860B5C.pdf; Supplier: LCSC; Type: 厚膜电阻; Tolerance: ±1%; Power(Watts): 1/10W; Temperature Coefficient: ±100ppm/; Overload Voltage (Max): 75V; Operating Temperature Range: -55~+155; JLCPCB Part Class: Basic Part
U12 = 带方向编码器A

## Nets
3V3: C3.1 C16.2 C25.1 C26.1 C40.1 CARD1.4(VDD) D8.1(C) H6.4 R3.1 R11.2 R12.2 R20.2 R21.2 R22.2 R23.2 R24.2 R25.2 R31.2 U1.2(VCC) U1.4(VCC) U2.3(OUTPUT) U12.2(3V3) U14.5(KEY3)
+3.3V: P4.16
+5V: BUZZER1.1(+) C6.1 C8.2 C15.2 C17.1 C18.1 C23.1 C27.1 C28.1 C29.1 C31.1 C33.1 C35.2 C41.2 C42.1 CN2.6 CN6.6 D4.1(A) D5.1(C) D9.1(A) H1.1 H2.1 H9.1 H9.4 H10.1 H11.1 H16.1 L1.1 L2.1 P2.1 R2.2 R6.1 R8.2 U15.1(INPUT)
+6V: C2.1 H3.2 H5.2 R5.1
GND: C1.2 C2.2 C3.2 C5.1 C6.2 C7.1 C8.1 C9.2 C10.1 C12.2 C13.1 C14.1 C16.1 C17.2 C18.2 C19.1 C20.1 C23.2 C24.1 C25.2 C26.2 C27.2 C28.2 C29.2 C30.1 C31.2 C33.2 C34.1 C35.1 C38.1 C39.1 C40.2 C41.1 C42.2 C43.2 CARD1.6(VSS) CARD1.10(GND) CARD1.11(GND) CARD1.12(GND) CARD1.13(GND) CN1.2 CN2.1 CN2.7 CN2.8 CN4.7 CN4.8 CN5.7 CN5.8 CN6.5 CN6.7 CN6.8 CN7.2 CN8.2 D1.2(K) D2.2(K) D3.2(A) D6.2(A) D8.2(A) D10.2(A) H1.2 H2.2 H3.3 H5.3 H6.2 H9.6 H9.7 H10.2 H11.2 H16.2 LED1.2(K) LED2.2(K) LED3.2(K) LED4.2(K) P1.2 P2.4 P3.2 P4.4 P4.14 P5.7 Q1.2(E) R9.1 R10.1 R14.2 R15.1 R16.1 R17.1 SW1.6(EH) SW1.7(EH) SW1.C SW1.E U1.1(GND) U1.3(GND) U2.2(GND) U3.6(GND) U3.9(PowerPAD) U7.6(GND) U7.9(PowerPAD) U12.1(GND) U15.2(GND)
VCC: C1.1 C5.2 C7.2 C12.1 C24.2 C34.2 CN8.1 D1.1(A) D2.1(A) P5.8 R4.1 R13.1 U3.7(VIN) U7.7(VIN) U13.1
00_0: P4.1 U1.99(00.0)
00_1: P4.3 U1.100(00.1)
00_2: P4.5 U1.101(00.2)
00_3: P4.7 U1.102(00.3)
00_4: P4.9 U1.103(00.4)
00_5: P4.11 U1.104(00.5)
00_6: P4.13 U1.105(00.6)
00_7: P4.15 U1.106(00.7)
ADC1: CN5.1 U1.9(A13)
ADC2: CN5.2 U1.11(A11)
ADC3: CN5.3 U1.13(A8)
ADC4: CN5.4 U1.15(A6)
ADC5: CN5.5 U1.17(A4)
ADC6: CN5.6 U1.19(A2)
ADC_BAT: R19.1 U1.20(A1)
BAT: CN1.1 CN7.1 U13.2
BEEP: R18.1 U1.28(33.10)
CAM_PCLK: H9.3 H9.8 P4.2 R15.2 U1.91(02.1)
CAM_RXD: P4.8
CAM_TXD: P4.6
CAM_VSY: H9.5 H9.10 P4.12 R16.2 U1.90(02.0)
CTRL_CH1: H12.1
CTRL_CH2: H12.2
CTRL_CH3: H12.3
CTRL_CH4: H12.4
CTRL_CH5: H12.5
CTRL_CH6: H12.6
D0: H6.1 U1.81(11.9)
D1: H6.3 U1.82(11.10)
D2: H6.5 U1.83(11.11)
D3: H6.7 U1.84(11.12)
D4: H6.9 U1.74(13.0)
D5: H6.11 U1.75(13.1)
D6: H6.13 U1.76(13.2)
D7: H6.15 U1.77(13.3)
DIR: U12.4(DIR)
EC11_A: C14.2 R1.1 U1.43(21.7)
EC11_B: C38.2 R7.1 U1.42(21.6)
GPIO1: CN4.2 U1.25(33.7)
GPIO2: CN4.4 U1.32(32.4)
GPIO3: CN4.6 U1.51(20.8)
GPIOIN: U1.49(20.6) U1.50(20.7)
GPS: C43.1 D10.1(C) P1.1 P3.1 U15.3(OUTPUT)
GPS1_RX: P1.4 U1.67(14.0)
GPS1_TX: P1.3 U1.68(14.1)
GPS2_RX: P3.4 U1.64(15.6)
GPS2_TX: P3.3 U1.65(15.7)
HALL_A: C39.2 R22.1 R26.1 U1.29(33.11)
HALL_B: C19.2 R23.1 R27.1 U1.30(33.12)
HALL_C: C20.2 R25.1 R30.1 U1.31(33.13)
KEY1: H1.6 U1.36(22.2) U14.6(KEY4)
KEY2: H1.4 U1.37(22.3) U14.7(KEY5)
KEY3: H1.5 U1.35(22.1) U14.8(GND)
KEY4: U1.39(21.3)
KEY5: U1.38(21.2)
KEY6: U1.40(21.4) U14.4(KEY2)
KEY_EC11: R31.1 SW1.D U1.41(21.5)
LSB: U12.3(LSB)
P02.2: P5.2 U1.92(02.2)
P02.3: P5.3 U1.93(02.3)
P02.4: P5.4 U1.94(02.4)
P02.5: P5.5 U1.95(02.5)
P02.6: P5.6 U1.96(02.6)
P11.6: P5.1 U1.80(11.6)
P20.0: H16.4 U1.44(20.0)
P20.3: H16.3 U1.46(20.3)
PWM1: CN4.1 U1.24(33.6)
PWM2: CN4.3 U1.26(33.8)
PWM3: CN4.5 U1.33(23.1)
PWM_SERVO: H3.1 H5.1 U1.27(33.9)
RX_3: P2.3 U1.53(20.10)
SOFT_SCL: H11.3 U1.22(33.4)
SOFT_SDA: H11.4 U1.23(33.5)
SPI1_CS: CARD1.2(CDDAT3(CS)) H10.6 U1.78(11.2)
SPI1_MISO: CARD1.7(DAT0(D0)) H10.5 R20.1 U1.85(10.1)
SPI1_MOSI: CARD1.3(CMD(DI)) H10.4 R21.1 U1.87(10.3)
SPI1_SCLK: CARD1.5(CLK(SCLK)) H10.3 R24.1 U1.86(10.2)
SPI3_SCLK: H1.3 U1.34(22.0)
SPI_CS_PIN: CN6.1 H2.6 U1.56(20.13)
SPI_MOSI_PIN: CN6.3 H2.4 U1.57(20.14)
SPI_MOSO_PIN: CN6.2 H2.5 U1.55(20.12)
SPI_SCK_PIN: CN6.4 H2.3 U1.54(20.11)
TFT_BL: H6.16 U1.62(15.4)
TFT_CS: H6.14 U1.60(15.2)
TFT_DC: H6.12 U1.58(15.0)
TFT_RES: H6.10 U1.59(15.1)
TFT_SCL: H6.6 U1.61(15.3)
TFT_SDA: H6.8 U1.63(15.5)
TX_3: P2.2 U1.52(20.9)
$1N5105: C9.1 C10.2 D4.2(K) D9.2(K) U2.1(INPUT)
$1N7239: LED3.1(A) R5.2
$1N7534: LED4.1(A) R6.2
$1N8911: LED2.1(A) R4.2
$1N19288: LED1.1(A) R3.2
$1N37513: C22.2 U7.1(BOOT)
$1N37515: C22.1 D6.1(K) L1.2 U7.8(PH)
$1N37517: R8.1 R9.2 U7.4(VSENSE)
$1N40288: C4.2 U3.1(BOOT)
$1N40290: C4.1 D3.1(K) L2.2 U3.8(PH)
$1N49327: R2.1 R10.2 U3.4(VSENSE)
$2N23716: C13.2 R13.2 R14.1 R19.2
$2N31818: R1.2 R12.1 SW1.A
$2N31849: R7.2 R11.1 SW1.B
$2N44868: C30.2 Q1.1(B) R17.2 R18.2
$2N44874: BUZZER1.2(-) C15.1 D5.2(A) Q1.3(C)
$2N61034: U1.66(15.8) U1.79(11.3)
$3N519: CN2.2 R30.2
$3N520: CN2.3 R27.2
$3N521: CN2.4 R26.2

Not connected (* = marked no-connect by the designer): CARD1 1(DAT2(RSV))* 8(DAT1(RSV))* 9(CD)*; CN2 5; H1 7 8; H2 7 8; H9 2 9 11 12; H10 7 8; P4 10*; P5 9* 10*; U1 5(A21) 6(A20) 7(A17) 8(A16) 10(A12) 12(A10) 14(A7) 16(A5) 18(A3) 21(A0) 45(20.2)* 47(ESR1) 48(ESR0) 69(14.2)* 70(14.3)* 71(14.4)* 72(14.5)* 73(14.6)* 88(10.5)* 89(10.6)* 97(02.7) 98(02.8) 107(00.8) 108(00.9) 109(00.12) 110(A49) 111(A48) 112(A47) 113(A46) 114(A45) 115(A44) 116(A39) 117(A38) 118(A37) 119(A36) 120(A35) 121(A25) 122(A24); U3 2(NC)* 3(NC)* 5(ENA)*; U7 2(NC)* 3(NC)* 5(ENA)*; U12 5(NC) 6(NC); U13 3; U14 1(5V) 2(3V3) 3(KEY1)

## Notes on the sheets
sheet 1
- 电压
- R1
- R2
- 4.995V
- 6.8K
- 2.2K
- 5.993V
- 6.8K
- 1.74K
- 3.3V-1.5A
- 7.027V
- 6.8K
- 1.43K
- 5V-GPS
- 1.221
- 1.221
sheet 2
- DIR_IN_PIN
- 2.4G无线串口
- 串口
- 此处Tx、Rx均为模块实际的引脚
- 摄像头要用到 一个UART中断
  TC264一共才有4个串口
- GPS
- TC264 V0.4
  1. 更改编码器DIR、LSB引脚
  2. 增加KEY6
  3. 预留SPI*2  SOFT_IIC*1
- 电池电压采样ADC
- 1. 增加了无刷GTM所需相关引脚连接【GPIO】
  2. 增加了6通道枪控接口
  3. 增加了2组预留SPI通道+1组软件IIC，并调整了部分SPI引脚
  4.预留了摄像头引脚
  A. 删除了无刷ADC采集相关接口
  B. 此版本开始GPS不再需要特殊的转接线
  C. 修改了按键引脚
- 逐飞核心板基准电压3.3V
- (dat/256)*3.3*(47+10)/10
- TC264 V0.4
  1. 更改编码器DIR、LSB引脚
  2. 增加KEY6
  3. 预留SPI*2  SOFT_IIC*1
sheet 3
- 当使用有刷时：
  全桥使用引脚2、3、4，
  3号为使能EN引脚
- 霍尔接口
- #define A_PHASE_PIN_H   IfxGtm_TOM0_2_TOUT28_P33_6_OUT  //电机A相上桥控制引脚
  #define A_PHASE_PIN_L   IfxGtm_TOM0_3_TOUT29_P33_7_OUT  //电机A相下桥控制引脚
  #define B_PHASE_PIN_H   IfxGtm_TOM0_4_TOUT30_P33_8_OUT  //电机B相上桥控制引脚
  #define B_PHASE_PIN_L   IfxGtm_TOM0_5_TOUT40_P32_4_OUT  //电机B相下桥控制引脚
  #define C_PHASE_PIN_H   IfxGtm_TOM0_6_TOUT42_P23_1_OUT  //电机B相上桥控制引脚
  #define C_PHASE_PIN_L   IfxGtm_TOM0_7_TOUT64_P20_8_OUT  //电机B相下桥控制引脚
- #define BOARD_POTENTIOMET_PORT  ADC2_CH11_A45     //板载电位器读取通道
  #define A_PHASE_PORT            ADC2_CH3_A35     //A相电流读取通道
  #define B_PHASE_PORT            ADC2_CH4_A36     //B相电流读取通道
  #define C_PHASE_PORT            ADC2_CH5_A37     //C相电流读取通道
  #define CENTER_PHASE_PORT       ADC2_CH6_A38     //母线电流读取通道
sheet 4
- 没有启用/没有画在PCB上
- 有刷测速编码器
